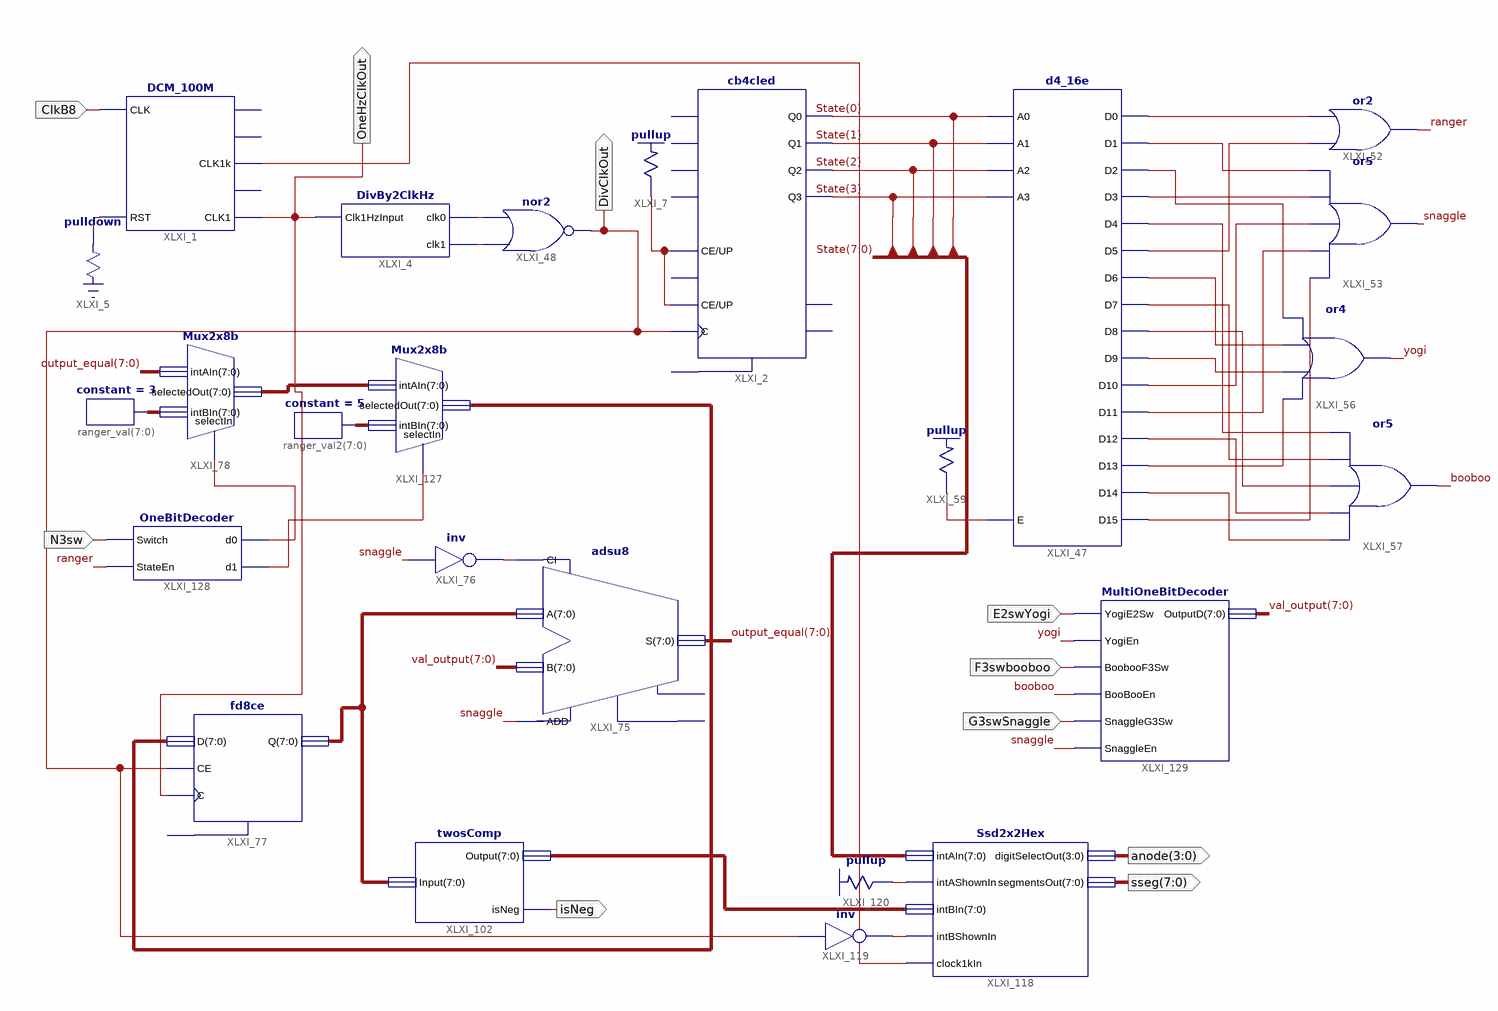
[diagram p0: schematic sheet 1]
// Xilinx ISE schematic Lab9Exp7mealy.sch (spartan3e) as structural Verilog: 25 symbols, 10 ports
module Lab9Exp7mealy (
  input  ClkB8,
  input  N3sw,
  input  E2swYogi,
  input  F3swbooboo,
  input  G3swSnaggle,
  output OneHzClkOut,
  output DivClkOut,
  output isNeg,
  output [7:0] sseg,
  output [3:0] anode
);

  wire booboo, clk0, clk1, ranger, snaggle, XLXN_2, XLXN_7, XLXN_248, XLXN_249, XLXN_254, XLXN_255, XLXN_280,
       XLXN_281, XLXN_282, XLXN_283, XLXN_284, XLXN_285, XLXN_286, XLXN_287, XLXN_288, XLXN_289, XLXN_290,
       XLXN_291, XLXN_297, XLXN_325, XLXN_425, XLXN_426, XLXN_428, XLXN_441, XLXN_444, yogi;
  wire [7:0] output_equal, State, val_output, XLXN_320, XLXN_395, XLXN_423, XLXN_437, XLXN_439, XLXN_449;

  DCM_100M XLXI_1 (.CLK(ClkB8), .RST(XLXN_2), .CLK1k(XLXN_425), .CLK1(OneHzClkOut));  // open: CLK1M, CLK10k, CLK100
  cb4cled XLXI_2 (
    .C(DivClkOut), .CE(XLXN_7), .UP(XLXN_7), .Q0(State[0]), .Q1(State[1]), .Q2(State[2]), .Q3(State[3]));  // open: CLR, D0, D1, D2, D3, L, CEO, TC
  DivBy2ClkHz XLXI_4 (.Clk1HzInput(OneHzClkOut), .clk0(clk0), .clk1(clk1));
  \pulldown  XLXI_5 (.O(XLXN_2));
  \pullup  XLXI_7 (.O(XLXN_7));
  d4_16e XLXI_47 (
    .A0(State[0]), .A1(State[1]), .A2(State[2]), .A3(State[3]), .E(XLXN_297), .D0(XLXN_248), .D1(XLXN_280),
    .D10(XLXN_282), .D11(XLXN_254), .D12(XLXN_290), .D13(XLXN_286), .D14(XLXN_291), .D15(XLXN_255),
    .D2(XLXN_283), .D3(XLXN_281), .D4(XLXN_287), .D5(XLXN_249), .D6(XLXN_284), .D7(XLXN_288), .D8(XLXN_289),
    .D9(XLXN_285));
  nor XLXI_48 (DivClkOut, clk1, clk0);
  or XLXI_52 (ranger, XLXN_249, XLXN_248);
  or XLXI_53 (snaggle, XLXN_255, XLXN_254, XLXN_282, XLXN_281, XLXN_280);
  or XLXI_56 (yogi, XLXN_286, XLXN_285, XLXN_284, XLXN_283);
  or XLXI_57 (booboo, XLXN_291, XLXN_290, XLXN_289, XLXN_288, XLXN_287);
  \pullup  XLXI_59 (.O(XLXN_297));
  twosComp XLXI_102 (.Input(XLXN_320), .Output(XLXN_423), .isNeg(isNeg));
  fd8ce XLXI_77 (.C(OneHzClkOut), .CE(DivClkOut), .D(XLXN_439), .Q(XLXN_320));  // open: CLR
  not XLXI_76 (XLXN_325, snaggle);
  adsu8 XLXI_75 (.A(XLXN_320), .ADD(snaggle), .B(val_output), .CI(XLXN_325), .S(output_equal));  // open: CO, OFL
  Ssd2x2Hex XLXI_118 (
    .intBIn(XLXN_423), .intAIn(State), .clock1kIn(XLXN_425), .intAShownIn(XLXN_428), .intBShownIn(XLXN_426),
    .digitSelectOut(anode), .segmentsOut(sseg));
  not XLXI_119 (XLXN_426, DivClkOut);
  \pullup  XLXI_120 (.O(XLXN_428));
  constant #(.CValue("3")) ranger_val[7:0] (.O(XLXN_395));
  Mux2x8b XLXI_78 (.selectedOut(XLXN_437), .selectIn(XLXN_441), .intBIn(XLXN_395), .intAIn(output_equal));
  Mux2x8b XLXI_127 (.selectedOut(XLXN_439), .selectIn(XLXN_444), .intBIn(XLXN_449), .intAIn(XLXN_437));
  OneBitDecoder XLXI_128 (.Switch(N3sw), .StateEn(ranger), .d0(XLXN_441), .d1(XLXN_444));
  MultiOneBitDecoder XLXI_129 (
    .YogiE2Sw(E2swYogi), .YogiEn(yogi), .BoobooF3Sw(F3swbooboo), .BooBooEn(booboo),
    .SnaggleG3Sw(G3swSnaggle), .SnaggleEn(snaggle), .OutputD(val_output));
  constant #(.CValue("5")) ranger_val2[7:0] (.O(XLXN_449));
endmodule
